# Altium schematic sheet Power_Board_5V.SchDoc
size A4; Date: 11-13-2024; ApprovedBy: Yi Ping; CheckedBy: Yi Ping; Author: Radioman; CompanyName: WXIT; DrawnBy: Radioman; Revision: V1; SheetNumber: 1; SheetTotal: 1; SPICEModelCacheNGACZHQT: <root> / <DocumentId>NGACZHQT</DocumentId> / <CacheFrame Number="0"> / <Model Name="10tq035" Kind="MDL"> / <Text>*10TQ035 MCE 3/26/98 / *Ref: IR Power Semiconductors Product Digest '94 / *MCE 35V 10A 3us pkg:TO-220 3,1 / .MODEL 10TQ035 D (IS=14.2N RS=4.2M N=1.7 BV=35 IBV=15M / + CJO=412P VJ=0.75 M=0.333 TT=4.32U EG=.69 XTI=2)</Text> / </Model> / </CacheFrame> / </root>; Time: 10:17
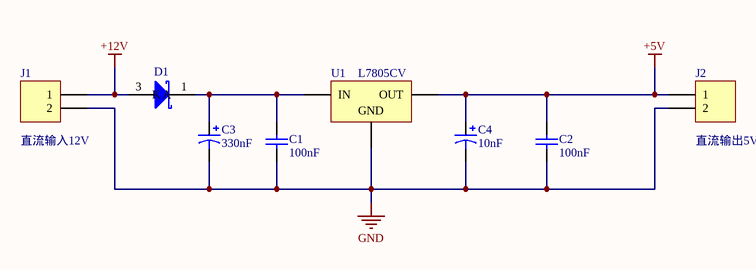
[diagram p0: Power_Board_5V.SchDoc]

## Parts
C1  value 100nF  [cap ceramic down]  (hidden comment: Cap)
C2  value 100nF  [cap ceramic down]  (hidden comment: Cap)
C3  value 330nF  [cap pol]  (hidden comment: Cap Pol1)
C4  value 10nF  [cap pol]  (hidden comment: Cap Pol1)
D1  Diode 10TQ035  [DO-35]  (value not drawn)
J1  Header 2  [Con-2]  (value not drawn)
J2  Header 2  [Con-2]  (value not drawn)
U1  L7805CV  [TO220]

## Nets
+5V: C2.2 C4.1 J2.1 U1.3(OUT)
+12V: D1.3(A) J1.1
GND: C1.2 C2.1 C3.2 C4.2 J1.2 J2.2 U1.2(GND)
NetC1_1: C1.1 C3.1 D1.1(K) U1.1(IN)

## Notes on the sheet
- (near J1) 直流输入12V
- (near J2) 直流输出5V

## Library data of the parts
C1 C2 = Cap: Capacitor; Published: 8-Jun-2000; LatestRevisionDate: 17-Jul-2002; LatestRevisionNote: Re-released for DXP Platform.; PackageReference: RAD-0.3; Publisher: Altium Limited; PackageDescription: Radial Cap, Thru-Hole; 2 Leads; 0.3 in Pin Spacing
C3 C4 = Cap Pol1: Polarized Capacitor (Radial); Published: 8-Jun-2000; LatestRevisionDate: 17-Jul-2002; LatestRevisionNote: Re-released for DXP Platform.; PackageReference: RB7.6-15; Publisher: Altium Limited; PackageDescription: Polarized Capacitor (Radial); 2 Leads
D1 = Diode 10TQ035: Schottky Rectifier; Note: Terminal 2 is the TAB and is electrically connected to the cathode; Published: 8-Jun-2000; LatestRevisionDate: 17-Jul-2002; LatestRevisionNote: Re-released for DXP Platform.; DatasheetVersion: PD-2.057B; PackageVersion: Feb-1998; PackageReference: TO-220AC; Publisher: Altium Limited; PackageDescription: TO, Thru-Hole, Vertical, Heatsink Mounted; 3 In-Line Leads (1 Absent); Pitch 2.54 mm; ComponentLink1Description: Manufacturer Link; ComponentLink1URL: http://www.irf.com/; ComponentLink2Description: Datasheet; ComponentLink2URL: http://www.irf.com/product-info/datasheets/data/10tq.pdf
J1 J2 = Header 2: Header, 2-Pin; LatestRevisionDate: 17-Jul-2002; LatestRevisionNote: Re-released for DXP Platform.; Publisher: Altium Limited
U1 = CMP-0244-00483-1: Positive Voltage Regulator, 5V, 3-Pin TO-220; PackageDescription: TO, Thru-Hole, Vertical, Heatsink Mounted; 3 In-Line Leads; Pitch 2.54 mm; ComponentLink2Description: Datasheet; PackageReference: TO220; ComponentLink3URL: http://www.st.com/internet/com/TECHNICAL_RESOURCES/TECHNICAL_LITERATURE/PACKAGE_INFORMATION/CD00004649.pdf; DatasheetVersion: 16/11/2011; ComponentLink1Description: Manufacturer URL; ComponentLink1URL: http://www.st.com; PackageVersion: ver3.0; ComponentLink3Description: Package Specification; ComponentLink2URL: http://www.st.com/internet/com/TECHNICAL_RESOURCES/TECHNICAL_LITERATURE/DATASHEET/CD00000444.pdf